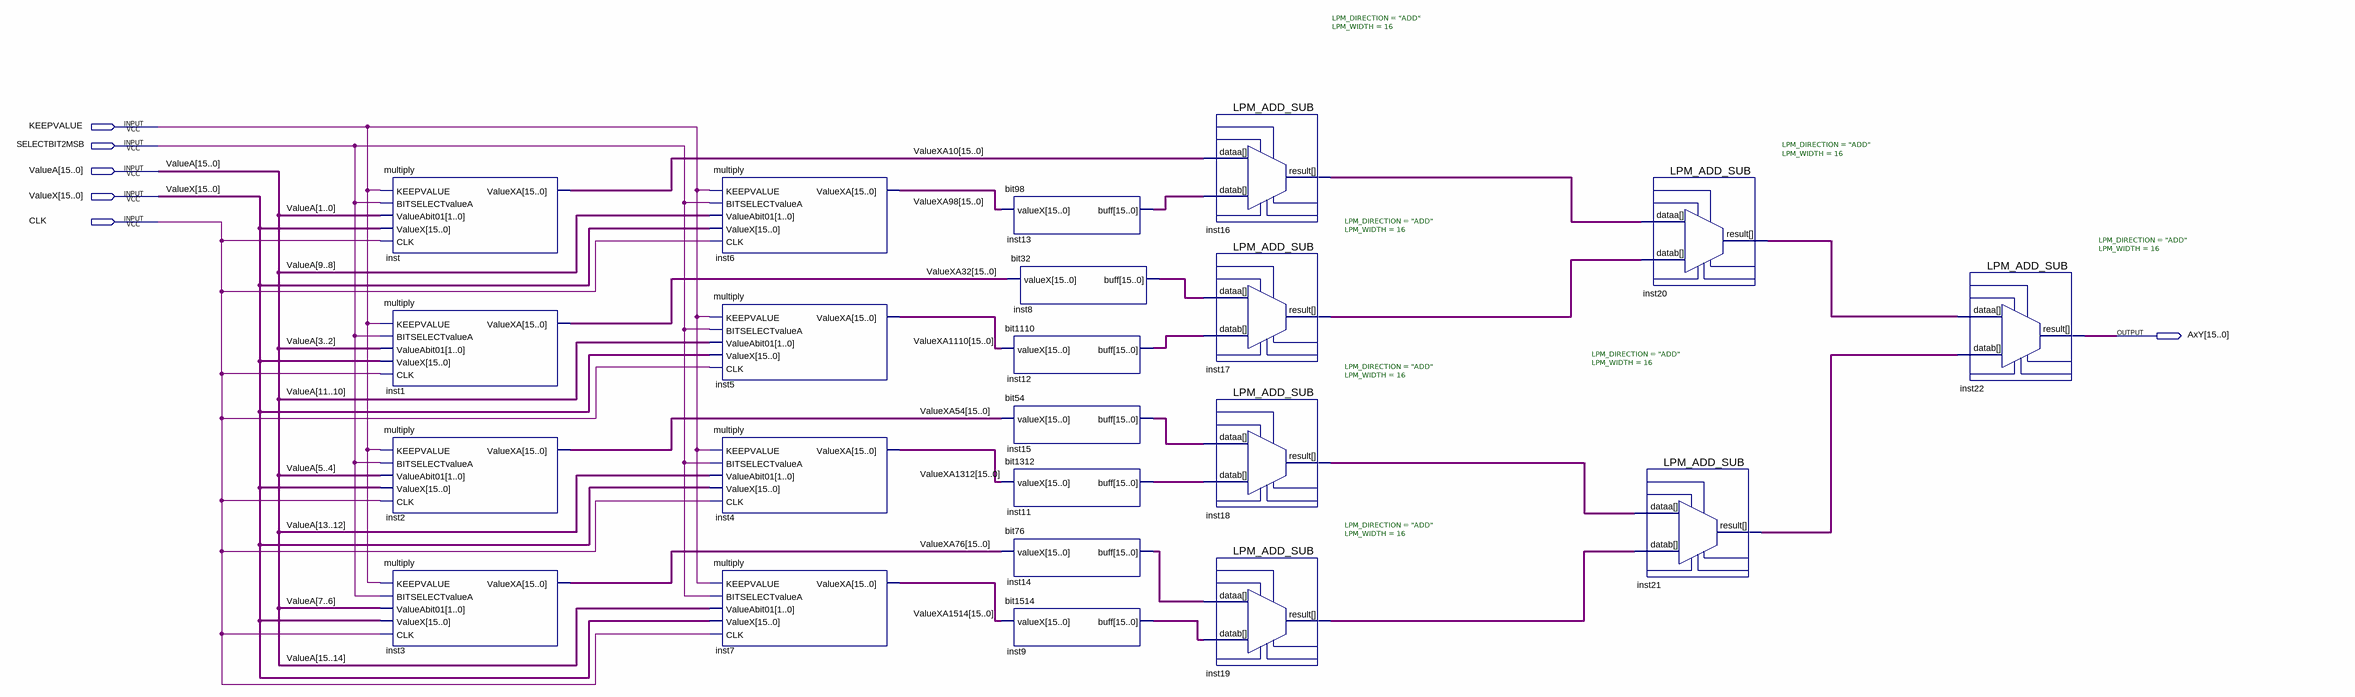
[diagram p0: schematic sheet]
// Quartus schematic multiply16.bdf as structural Verilog: 22 symbols, 6 pins
module multiply16 (
  input  KEEPVALUE,
  input  SELECTBIT2MSB,
  input  [15:0] ValueA,
  input  [15:0] ValueX,
  input  CLK,
  output [15:0] AxY
);

  wire [15:0] inst8_buff, inst9_buff, inst11_buff, inst12_buff, inst13_buff, inst14_buff, inst15_buff,
       inst16_result, inst17_result, inst18_result, inst19_result, inst20_result, inst21_result, ValueXA10,
       ValueXA32, ValueXA54, ValueXA76, ValueXA98, ValueXA1110, ValueXA1312, ValueXA1514;

  multiply inst (
    .KEEPVALUE(KEEPVALUE), .BITSELECTvalueA(SELECTBIT2MSB), .ValueAbit01(ValueA[1:0]), .ValueX(ValueX),
    .CLK(CLK), .ValueXA(ValueXA10));
  multiply inst1 (
    .KEEPVALUE(KEEPVALUE), .BITSELECTvalueA(SELECTBIT2MSB), .ValueAbit01(ValueA[3:2]), .ValueX(ValueX),
    .CLK(CLK), .ValueXA(ValueXA32));
  multiply inst2 (
    .KEEPVALUE(KEEPVALUE), .BITSELECTvalueA(SELECTBIT2MSB), .ValueAbit01(ValueA[5:4]), .ValueX(ValueX),
    .CLK(CLK), .ValueXA(ValueXA54));
  multiply inst3 (
    .KEEPVALUE(KEEPVALUE), .BITSELECTvalueA(SELECTBIT2MSB), .ValueAbit01(ValueA[7:6]), .ValueX(ValueX),
    .CLK(CLK), .ValueXA(ValueXA76));
  multiply inst6 (
    .KEEPVALUE(KEEPVALUE), .BITSELECTvalueA(SELECTBIT2MSB), .ValueAbit01(ValueA[9:8]), .ValueX(ValueX),
    .CLK(CLK), .ValueXA(ValueXA98));
  multiply inst5 (
    .KEEPVALUE(KEEPVALUE), .BITSELECTvalueA(SELECTBIT2MSB), .ValueAbit01(ValueA[11:10]), .ValueX(ValueX),
    .CLK(CLK), .ValueXA(ValueXA1110));
  multiply inst4 (
    .KEEPVALUE(KEEPVALUE), .BITSELECTvalueA(SELECTBIT2MSB), .ValueAbit01(ValueA[13:12]), .ValueX(ValueX),
    .CLK(CLK), .ValueXA(ValueXA1312));
  multiply inst7 (
    .KEEPVALUE(KEEPVALUE), .BITSELECTvalueA(SELECTBIT2MSB), .ValueAbit01(ValueA[15:14]), .ValueX(ValueX),
    .CLK(CLK), .ValueXA(ValueXA1514));
  bit98 inst13 (.valueX(ValueXA98), .buff(inst13_buff));
  bit32 inst8 (.valueX(ValueXA32), .buff(inst8_buff));
  bit1110 inst12 (.valueX(ValueXA1110), .buff(inst12_buff));
  bit54 inst15 (.valueX(ValueXA54), .buff(inst15_buff));
  bit1312 inst11 (.valueX(ValueXA1312), .buff(inst11_buff));
  bit76 inst14 (.valueX(ValueXA76), .buff(inst14_buff));
  bit1514 inst9 (.valueX(ValueXA1514), .buff(inst9_buff));
  LPM_ADD_SUB #(.LPM_DIRECTION("ADD"), .LPM_WIDTH(16)) inst16 (
    .dataa(ValueXA10), .datab(inst13_buff), .result(inst16_result));
  LPM_ADD_SUB #(.LPM_DIRECTION("ADD"), .LPM_WIDTH(16)) inst17 (
    .dataa(inst8_buff), .datab(inst12_buff), .result(inst17_result));
  LPM_ADD_SUB #(.LPM_DIRECTION("ADD"), .LPM_WIDTH(16)) inst18 (
    .dataa(inst15_buff), .datab(inst11_buff), .result(inst18_result));
  LPM_ADD_SUB #(.LPM_DIRECTION("ADD"), .LPM_WIDTH(16)) inst19 (
    .dataa(inst14_buff), .datab(inst9_buff), .result(inst19_result));
  LPM_ADD_SUB #(.LPM_DIRECTION("ADD"), .LPM_WIDTH(16)) inst20 (
    .dataa(inst16_result), .datab(inst17_result), .result(inst20_result));
  LPM_ADD_SUB #(.LPM_DIRECTION("ADD"), .LPM_WIDTH(16)) inst21 (
    .dataa(inst18_result), .datab(inst19_result), .result(inst21_result));
  LPM_ADD_SUB #(.LPM_DIRECTION("ADD"), .LPM_WIDTH(16)) inst22 (
    .dataa(inst20_result), .datab(inst21_result), .result(AxY));
endmodule
